# Altium project UpperAviPower9-2.PrjPCB
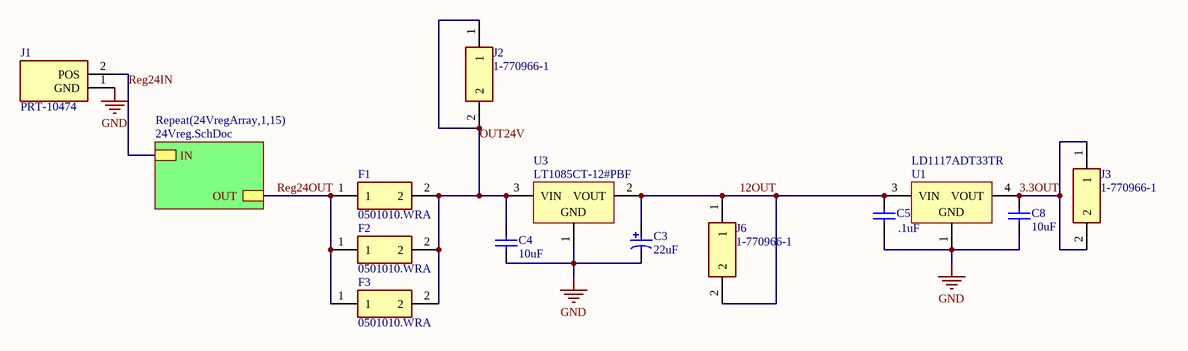
[diagram p0: powerPCB9-2.SchDoc]
2 sheets, 73 parts. Net scope: hierarchical (ports join the sheet entries above them; power ports are global).
Board file: PCB1.PcbDoc
Sheets:
  powerPCB9-2.SchDoc
    24VregArray1 = 24Vreg.SchDoc
    24VregArray2 = 24Vreg.SchDoc
    24VregArray3 = 24Vreg.SchDoc
    24VregArray4 = 24Vreg.SchDoc
    24VregArray5 = 24Vreg.SchDoc
    24VregArray6 = 24Vreg.SchDoc
    24VregArray7 = 24Vreg.SchDoc
    24VregArray8 = 24Vreg.SchDoc
    24VregArray9 = 24Vreg.SchDoc
    24VregArray10 = 24Vreg.SchDoc
    24VregArray11 = 24Vreg.SchDoc
    24VregArray12 = 24Vreg.SchDoc
    24VregArray13 = 24Vreg.SchDoc
    24VregArray14 = 24Vreg.SchDoc
    24VregArray15 = 24Vreg.SchDoc

## Sheet powerPCB9-2.SchDoc
size A

### Parts
C3  22uF  [KEMT-D-7343-31-2_L]
C4  10uF  [CAPC2013X135X45ML10T25]
C5  .1uF  [CAPC2013X135X45ML10T25]
C8  10uF  [CAPC2013X135X45ML10T25]
F1  0501010.WRA  [FUSC3216X98N]
F2  0501010.WRA  [FUSC3216X98N]
F3  0501010.WRA  [FUSC3216X98N]
J1  PRT-10474  [SHDR2W320P716_1X2_1574X813X1588P]
J2  1-770966-1  [17709661]
J3  1-770966-1  [17709661]
J6  1-770966-1  [17709661]
U1  LD1117ADT33TR  [TO-252_L]
U3  LT1085CT-12#PBF  [LT-T-3]

### Sub-sheets
Repeat(24VregArray,1,15) = 24Vreg.SchDoc: OUT, IN

### Nets
GND: C3.2 C4.1 C5.1 C8.1 J1.1(GND) U1.1(GND) U3.1(GND)
3.3OUT: C8.2 J3.1 J3.2 U1.4(VOUT)
12OUT: C3.1 C5.2 J6.1 J6.2 U1.3(VIN) U3.2(VOUT)
OUT24V: C4.2 F1.2 F2.2 F3.2 J2.1 J2.2 U3.3(VIN)
Reg24IN: J1.2(POS) ; sheet Repeat(24VregArray,1,15)/IN
Reg24OUT: F1.1 F2.1 F3.1 ; sheet Repeat(24VregArray,1,15)/OUT

### Library data of the parts
C3 = CMP-2000-07210-1: Capacitor, Tantalum, 22 uF, +/- 10%, 35 V, -55 to 125 degC, 2-Pin Molded, RoHS, Tape and Reel; Manufacturer: Kemet; Seal: NotRequired; Voltage: 35VDC; Product Diameter (mm): NotRequiredmm; DCL: 7.7uA; ESR: 0.3ohm; Product Depth (mm): 4.3mm; Polarity: Polar; Capacitance: 22000000pF; DF: 6%; Product Height (mm): 2.8mm; Product Length (mm): 7.3mm; Rad Hardened: No; Mounting Technology: SurfaceMount; Packaging: TapeandReel; Case Code: D; Datasheet URL: https://datasheet.ciiva.com/28561/1780647-28561674.pdf; Case Style: Molded; Datasheet Version: 12/2013; Length W/Weld: NotRequiredmm; Insulation: NotRequired; Construction: SMTChip; Operating Temp Range: -55Cto125C; Lead Spacing (nom): NotRequiredmm; Package Description: 2-Pin Surface Mount Device, Body 7.3 x 4.3 mm, Height 3.1 mm; Package Reference: Molded-2; Wire Form: NotRequired; Length W/Weld (max): NotRequiredmm; Manufacturer URL: http://www.kemet.com/; Mounting Style: SurfaceMount; Tolerance (+ or -): 10%; Seated Plane Height: NotRequiredmm; Failure Rate: NotRequired; Package / Case: 7343-31
C4 C8 = CMP-2007-03541-1: Part Number: GRM21BR61E106KA73L; Manufacturer: Murata
C5 = CMP-2100-03644-1: Chip Capacitor, 0.1 uF, +/- 10%, 50 V, -55 to 125 degC, 0805 (2012 Metric), RoHS, Tape and Reel; Manufacturer: Murata; Voltage: 50V; Capacitance: 100nF; Insulation Resistance: 10GR; Dielectric Material: Ceramic; Dielectric: X7R; Package Description: 2-Pin Surface Mount Device, Body 2 x 1.25 mm; Manufacturer URL: http://www.murata.com/; Case Code (Imperial): 0805; Datasheet URL: http://psearch.en.murata.com/capacitor/product/GRM21BR71H104KA01%23.pdf; Termination: SMD/SMT; Lead Free: LeadFree; Package Quantity: 1; Mount: SurfaceMount; REACH SVHC: Unknown; Thickness: 0.053inch; Height: 1.25mm; Case/Package: 0805; Voltage Rating: 50V; Width: 0.049inch; Case Code (Metric): 2012; Material: Ceramic; Min Operating Temperature: -55degC; RoHSCompliant: true; Datasheet Version: 42675.0; Voltage Rating (DC): 50V; Tolerance: 10%; Package Reference: 0805; Depth: 1.25mm; Length: 2mm; Max Operating Temperature: 125degC; Packaging: TapeandReel; Number of Pins: 2; Radiation Hardening: No
F1-F3 = 0501010.WRA: Fuse; Manufacturer_Name: LITTELFUSE; Datasheet Link: https://www.littelfuse.com/~/media/electronics/datasheets/fuses/littelfuse_fuse_501_datasheet.pdf.pdf; Height: 0.985mm; Manufacturer_Part_Number: 0501010.WRA; Mouser Part Number: 576-0501010.WRA; Mouser Price/Stock: https://www.mouser.com/Search/Refine.aspx?Keyword=576-0501010.WRA
J1 = PRT-10474: Connector; Manufacturer_Name: SparkFun; Datasheet Link: http://cdn.sparkfun.com/datasheets/Prototyping/xt60.pdf; Height: 15.875mm; Manufacturer_Part_Number: PRT-10474; Mouser Part Number: 474-PRT-10474; Mouser Price/Stock: https://www.mouser.com/Search/Refine.aspx?Keyword=474-PRT-10474
J2 J3 J6 = 1-770966-1: Connector; Manufacturer_Name: TE Connectivity; Allied_Number: 70084920; Datasheet Link: https://www.te.com/commerce/DocumentDelivery/DDEController?Action=showdoc&DocId=Customer+Drawing%7F770966%7FG1%7Fpdf%7FEnglish%7FENG_CD_770966_G1.pdf%7F1-770966-1; Height: 7.77mm; Manufacturer_Part_Number: 1-770966-1; Mouser Part Number: 571-1-770966-1; Mouser Price/Stock: https://www.mouser.com/Search/Refine.aspx?Keyword=571-1-770966-1; RS Part Number: 7099906; RS Price/Stock: https://uk.rs-online.com/web/p/products/7099906; Allied Price/Stock: https://www.alliedelec.com/teconnectivity-1-770966-1/70084920/
U1 = CMP-0244-00137-1: 1A, Low Drop Positive Voltage Regulator, 3.3V, 3-Pin DPAK, Tape and Reel; ComponentLink2URL: http://www.st.com/internet/com/TECHNICAL_RESOURCES/TECHNICAL_LITERATURE/DATASHEET/CD00002116.pdf; ComponentLink2Description: Datasheet; ComponentLink1URL: http://www.st.com; PackageDescription: 3-Pin Transistor Outline Package 2.28 mm Pitch, 9.7 mm Lead Span (DPAK); ComponentLink1Description: Manufacturer URL; PackageVersion: 2011; PackageReference: TO-252; DatasheetVersion: 2/12/2011
U3 = CMP-0476-01889-1: 3 A Low Dropout Positive Regulator, 4.3 to 25 V Vin, 12 V Vout, 3-pin FM (T-3), 0 to 150 degC, Pb-Free; Manufacturer: Linear Technology; Discrete Pass Element: no; Iout(mA): 3000; Vin Min(V): 4.3; Vin Max(V): 25; Dropout Voltage(V): 1.3; PSRR(dB): 72; Number of Outputs: 1; Output Voltage: 12 V; Isupply(mA): 5; ComponentLink3URL: http://cds.linear.com/docs/en/packaging/TO-220_3_05-08-1420.pdf; PackageVersion: Jun-10; ComponentLink2Description: Datasheet; Mounting Technology: Through Hole; PackageDescription: 3-Pin Plastic TO-220, Body 10.2235 x 4.3815 mm, Pitch 2.54 mm; ComponentLink1URL: http://www.linear.com/; PartNumber: LT1085CT-12#PBF; RoHS: TRUE; DatasheetVersion: Rev. D; PackageReference: T-3; ComponentLink2URL: http://cds.linear.com/docs/en/datasheet/1083ffd.pdf; ComponentLink3Description: Package Specification; ComponentLink1Description: Manufacturer URL

## Sheet 24Vreg.SchDoc
size A
Used 15 times, as channels 24VregArray1, 24VregArray2, 24VregArray3, 24VregArray4, 24VregArray5, 24VregArray6, 24VregArray7, 24VregArray8, 24VregArray9, 24VregArray10, 24VregArray11, 24VregArray12, 24VregArray13, 24VregArray14, 24VregArray15. Parts and nets are listed once, with the designators drawn on the sheet.
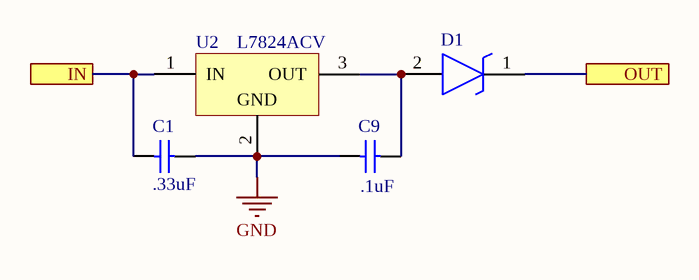
[diagram p1: 24Vreg.SchDoc]

### Parts
C1  .33uF  [CAPC2013X140X50ML20T25]
C9  .1uF  [CAPC2013X135X45ML10T25]
D1  PMEG3020DEP,115  [PMEG3050EP115]  (value not drawn)
U2  L7824ACV  [TO220]

### Ports
IN, OUT

### Nets
GND: C1.2 C9.1 U2.2(GND)
IN: C1.1 U2.1(IN) ; port IN
OUT: D1.1(K) ; port OUT
NetC9_2: C9.2 D1.2(A) U2.3(OUT)

### Channels
24VregArray1: designators end in _24VregArray1; ports IN=Reg24IN OUT=Reg24OUT
24VregArray2: designators end in _24VregArray2; ports IN=Reg24IN OUT=Reg24OUT
24VregArray3: designators end in _24VregArray3; ports IN=Reg24IN OUT=Reg24OUT
24VregArray4: designators end in _24VregArray4; ports IN=Reg24IN OUT=Reg24OUT
24VregArray5: designators end in _24VregArray5; ports IN=Reg24IN OUT=Reg24OUT
24VregArray6: designators end in _24VregArray6; ports IN=Reg24IN OUT=Reg24OUT
24VregArray7: designators end in _24VregArray7; ports IN=Reg24IN OUT=Reg24OUT
24VregArray8: designators end in _24VregArray8; ports IN=Reg24IN OUT=Reg24OUT
24VregArray9: designators end in _24VregArray9; ports IN=Reg24IN OUT=Reg24OUT
24VregArray10: designators end in _24VregArray10; ports IN=Reg24IN OUT=Reg24OUT
24VregArray11: designators end in _24VregArray11; ports IN=Reg24IN OUT=Reg24OUT
24VregArray12: designators end in _24VregArray12; ports IN=Reg24IN OUT=Reg24OUT
24VregArray13: designators end in _24VregArray13; ports IN=Reg24IN OUT=Reg24OUT
24VregArray14: designators end in _24VregArray14; ports IN=Reg24IN OUT=Reg24OUT
24VregArray15: designators end in _24VregArray15; ports IN=Reg24IN OUT=Reg24OUT

### Library data of the parts
C1 = CMP-2007-04618-1: Manufacturer: AVX Interconnect / Elco; Part Number: 08053G334ZAT2A
C9 = CMP-2100-03644-1: as C5 on sheet powerPCB9-2; Package Description: 2-Pin Surface Mount Device, Body 2 x 1.25 mm; Manufacturer URL: http://www.murata.com/; Case Code (Imperial): 0805; Datasheet URL: http://psearch.en.murata.com/capacitor/product/GRM21BR71H104KA01%23.pdf; Termination: SMD/SMT; Lead Free: LeadFree; Package Quantity: 1; Mount: SurfaceMount; REACH SVHC: Unknown; Thickness: 0.053inch; Height: 1.25mm; Case/Package: 0805; Voltage Rating: 50V; Width: 0.049inch; Case Code (Metric): 2012; Material: Ceramic; Min Operating Temperature: -55degC; RoHSCompliant: true; Datasheet Version: 42675.0; Voltage Rating (DC): 50V; Tolerance: 10%; Package Reference: 0805; Depth: 1.25mm; Length: 2mm; Max Operating Temperature: 125degC; Packaging: TapeandReel; Number of Pins: 2; Radiation Hardening: No
D1 = PMEG3020DEP,115: Schottky Diode; Manufacturer_Name: Nexperia; Datasheet Link: https://assets.nexperia.com/documents/data-sheet/PMEG3020DEP.pdf; Height: 1mm; Manufacturer_Part_Number: PMEG3020DEP,115; Mouser Part Number: 771-PMEG3020DEP115; Mouser Price/Stock: https://www.mouser.com/Search/Refine.aspx?Keyword=771-PMEG3020DEP115; RS Part Number: 1513202; RS Price/Stock: https://uk.rs-online.com/web/p/products/1513202
U2 = CMP-0244-00465-1: Positive Voltage Regulator, 24V, 3-Pin TO-220; ComponentLink3Description: Package Specification; PackageReference: TO220; ComponentLink1Description: Manufacturer URL; PackageDescription: TO, Thru-Hole, Vertical, Heatsink Mounted; 3 In-Line Leads; Pitch 2.54 mm; ComponentLink1URL: http://www.st.com; DatasheetVersion: 16/11/2011; ComponentLink3URL: http://www.st.com/internet/com/TECHNICAL_RESOURCES/TECHNICAL_LITERATURE/PACKAGE_INFORMATION/CD00004649.pdf; ComponentLink2Description: Datasheet; ComponentLink2URL: http://www.st.com/internet/com/TECHNICAL_RESOURCES/TECHNICAL_LITERATURE/DATASHEET/CD00000444.pdf; PackageVersion: ver3.0

## Nets that join several sheets
GND: powerPCB9-2 (7 pins), 24VregArray1 (C1_24VregArray1.2 C9_24VregArray1.1 U2_24VregArray1.2), 24VregArray2 (C1_24VregArray2.2 C9_24VregArray2.1 U2_24VregArray2.2), 24VregArray3 (C1_24VregArray3.2 C9_24VregArray3.1 U2_24VregArray3.2), 24VregArray4 (C1_24VregArray4.2 C9_24VregArray4.1 U2_24VregArray4.2), 24VregArray5 (C1_24VregArray5.2 C9_24VregArray5.1 U2_24VregArray5.2), 24VregArray6 (C1_24VregArray6.2 C9_24VregArray6.1 U2_24VregArray6.2), 24VregArray7 (C1_24VregArray7.2 C9_24VregArray7.1 U2_24VregArray7.2), 24VregArray8 (C1_24VregArray8.2 C9_24VregArray8.1 U2_24VregArray8.2), 24VregArray9 (C1_24VregArray9.2 C9_24VregArray9.1 U2_24VregArray9.2), 24VregArray10 (C1_24VregArray10.2 C9_24VregArray10.1 U2_24VregArray10.2), 24VregArray11 (C1_24VregArray11.2 C9_24VregArray11.1 U2_24VregArray11.2), 24VregArray12 (C1_24VregArray12.2 C9_24VregArray12.1 U2_24VregArray12.2), 24VregArray13 (C1_24VregArray13.2 C9_24VregArray13.1 U2_24VregArray13.2), 24VregArray14 (C1_24VregArray14.2 C9_24VregArray14.1 U2_24VregArray14.2), 24VregArray15 (C1_24VregArray15.2 C9_24VregArray15.1 U2_24VregArray15.2)
Reg24IN: powerPCB9-2 (J1.2), 24VregArray1 (C1_24VregArray1.1 U2_24VregArray1.1), 24VregArray2 (C1_24VregArray2.1 U2_24VregArray2.1), 24VregArray3 (C1_24VregArray3.1 U2_24VregArray3.1), 24VregArray4 (C1_24VregArray4.1 U2_24VregArray4.1), 24VregArray5 (C1_24VregArray5.1 U2_24VregArray5.1), 24VregArray6 (C1_24VregArray6.1 U2_24VregArray6.1), 24VregArray7 (C1_24VregArray7.1 U2_24VregArray7.1), 24VregArray8 (C1_24VregArray8.1 U2_24VregArray8.1), 24VregArray9 (C1_24VregArray9.1 U2_24VregArray9.1), 24VregArray10 (C1_24VregArray10.1 U2_24VregArray10.1), 24VregArray11 (C1_24VregArray11.1 U2_24VregArray11.1), 24VregArray12 (C1_24VregArray12.1 U2_24VregArray12.1), 24VregArray13 (C1_24VregArray13.1 U2_24VregArray13.1), 24VregArray14 (C1_24VregArray14.1 U2_24VregArray14.1), 24VregArray15 (C1_24VregArray15.1 U2_24VregArray15.1)
Reg24OUT: powerPCB9-2 (F1.1 F2.1 F3.1), 24VregArray1 (D1_24VregArray1.1), 24VregArray2 (D1_24VregArray2.1), 24VregArray3 (D1_24VregArray3.1), 24VregArray4 (D1_24VregArray4.1), 24VregArray5 (D1_24VregArray5.1), 24VregArray6 (D1_24VregArray6.1), 24VregArray7 (D1_24VregArray7.1), 24VregArray8 (D1_24VregArray8.1), 24VregArray9 (D1_24VregArray9.1), 24VregArray10 (D1_24VregArray10.1), 24VregArray11 (D1_24VregArray11.1), 24VregArray12 (D1_24VregArray12.1), 24VregArray13 (D1_24VregArray13.1), 24VregArray14 (D1_24VregArray14.1), 24VregArray15 (D1_24VregArray15.1)